# EAGLE design ring24 (EAGLE 6.4)
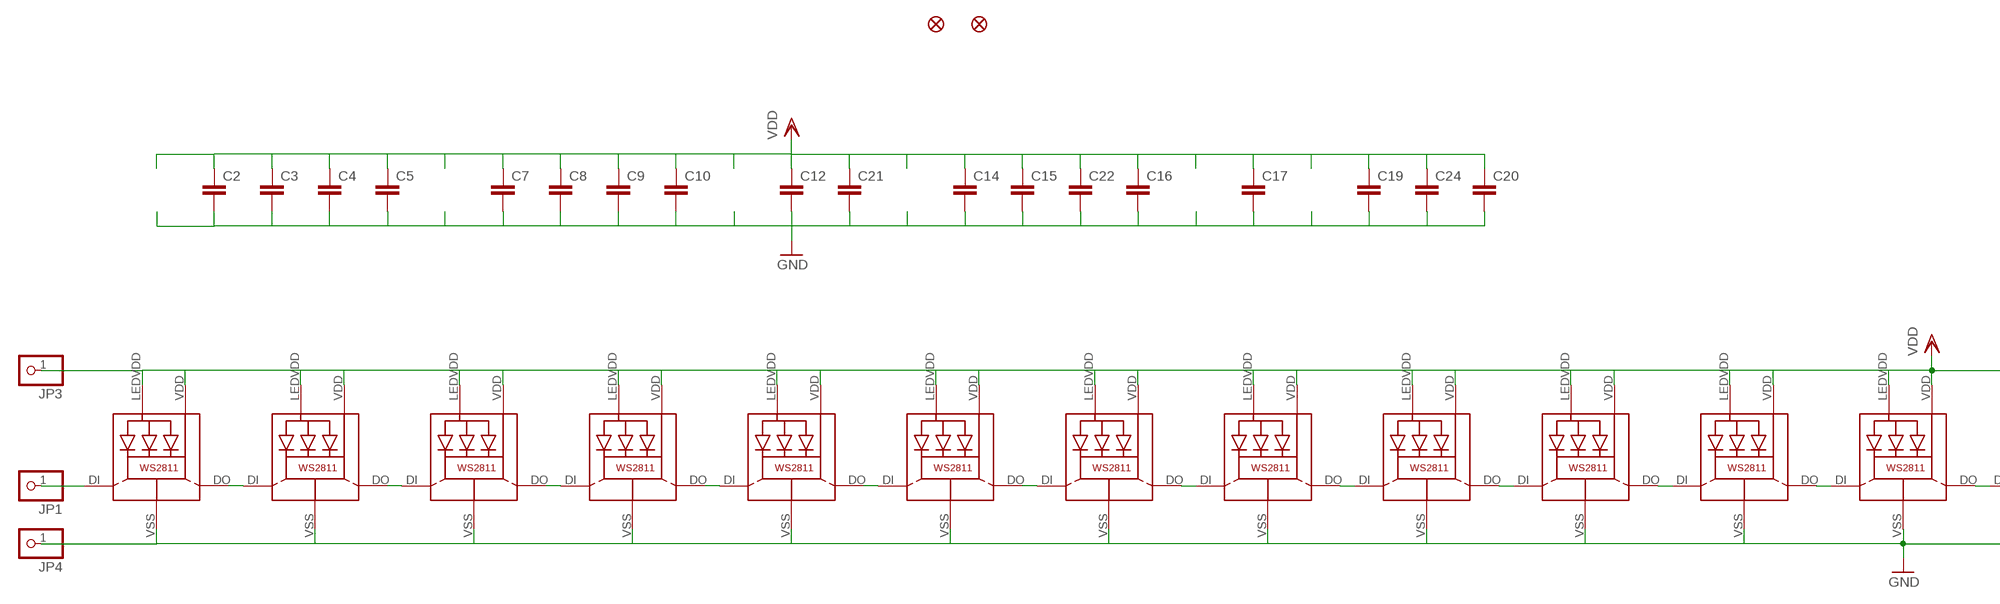
[diagram p0: schematic, sheet 1, part 1 of 2]
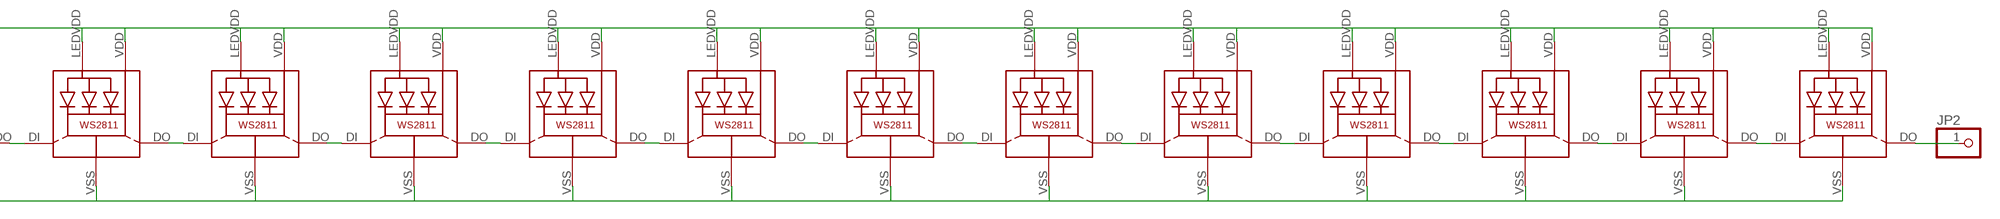
[diagram p1: schematic, sheet 1, part 2 of 2]

## Parts
C2  C-EUC0603  [C0603]
C3  C-EUC0603  [C0603]
C4  C-EUC0603  [C0603]
C5  C-EUC0603  [C0603]
C7  C-EUC0603  [C0603]
C8  C-EUC0603  [C0603]
C9  C-EUC0603  [C0603]
C10  C-EUC0603  [C0603]
C12  C-EUC0603  [C0603]
C14  C-EUC0603  [C0603]
C15  C-EUC0603  [C0603]
C16  C-EUC0603  [C0603]
C17  C-EUC0603  [C0603]
C19  C-EUC0603  [C0603]
C20  C-EUC0603  [C0603]
C21  C-EUC0603  [C0603]
C22  C-EUC0603  [C0603]
C24  C-EUC0603  [C0603]
FID1  FIDUCIAL""  [FIDUCIAL_1MM]
FID2  FIDUCIAL""  [FIDUCIAL_1MM]
JP1  PINHD-1X1CB  [1X01-CLEANBIG]
JP2  PINHD-1X1CB  [1X01-CLEANBIG]
JP3  PINHD-1X1CB  [1X01-CLEANBIG]
JP4  PINHD-1X1CB  [1X01-CLEANBIG]
LED1  WS28115050  [WS28115050]
LED2  WS28115050  [WS28115050]
LED3  WS28115050  [WS28115050]
LED4  WS28115050  [WS28115050]
LED5  WS28115050  [WS28115050]
LED6  WS28115050  [WS28115050]
LED7  WS28115050  [WS28115050]
LED8  WS28115050  [WS28115050]
LED9  WS28115050  [WS28115050]
LED10  WS28115050  [WS28115050]
LED11  WS28115050  [WS28115050]
LED12  WS28115050  [WS28115050]
LED13  WS28115050  [WS28115050]
LED14  WS28115050  [WS28115050]
LED15  WS28115050  [WS28115050]
LED16  WS28115050  [WS28115050]
LED17  WS28115050  [WS28115050]
LED18  WS28115050  [WS28115050]
LED19  WS28115050  [WS28115050]
LED20  WS28115050  [WS28115050]
LED21  WS28115050  [WS28115050]
LED22  WS28115050  [WS28115050]
LED23  WS28115050  [WS28115050]
LED24  WS28115050  [WS28115050]

## Nets
GND: C2.2 C3.2 C4.2 C5.2 C7.2 C8.2 C9.2 C10.2 C12.2 C14.2 C15.2 C16.2 C17.2 C19.2 C20.2 C21.2 C22.2 C24.2 JP4.1 LED1.VSS(GND) LED2.VSS(GND) LED3.VSS(GND) LED4.VSS(GND) LED5.VSS(GND) LED6.VSS(GND) LED7.VSS(GND) LED8.VSS(GND) LED9.VSS(GND) LED10.VSS(GND) LED11.VSS(GND) LED12.VSS(GND) LED13.VSS(GND) LED14.VSS(GND) LED15.VSS(GND) LED16.VSS(GND) LED17.VSS(GND) LED18.VSS(GND) LED19.VSS(GND) LED20.VSS(GND) LED21.VSS(GND) LED22.VSS(GND) LED23.VSS(GND) LED24.VSS(GND)
N$1: LED1.DO LED2.DI
N$2: LED2.DO LED3.DI
N$3: LED3.DO LED4.DI
N$4: LED4.DO LED5.DI
N$5: LED5.DO LED6.DI
N$6: LED6.DO LED7.DI
N$7: LED7.DO LED8.DI
N$8: LED8.DO LED9.DI
N$9: LED9.DO LED10.DI
N$10: LED10.DO LED11.DI
N$11: LED11.DO LED12.DI
N$12: LED12.DO LED13.DI
N$13: LED13.DO LED14.DI
N$14: LED14.DO LED15.DI
N$15: LED15.DO LED16.DI
N$16: LED16.DO LED17.DI
N$17: LED17.DO LED18.DI
N$18: LED18.DO LED19.DI
N$19: LED19.DO LED20.DI
N$20: LED20.DO LED21.DI
N$21: LED21.DO LED22.DI
N$22: LED22.DO LED23.DI
N$23: LED23.DO LED24.DI
N$24: JP2.1 LED24.DO
N$26: JP1.1 LED1.DI
VDD: C2.1 C3.1 C4.1 C5.1 C7.1 C8.1 C9.1 C10.1 C12.1 C14.1 C15.1 C16.1 C17.1 C19.1 C20.1 C21.1 C22.1 C24.1 JP3.1 LED1.LEDVDD LED1.VDD LED2.LEDVDD LED2.VDD LED3.LEDVDD LED3.VDD LED4.LEDVDD LED4.VDD LED5.LEDVDD LED5.VDD LED6.LEDVDD LED6.VDD LED7.LEDVDD LED7.VDD LED8.LEDVDD LED8.VDD LED9.LEDVDD LED9.VDD LED10.LEDVDD LED10.VDD LED11.LEDVDD LED11.VDD LED12.LEDVDD LED12.VDD LED13.LEDVDD LED13.VDD LED14.LEDVDD LED14.VDD LED15.LEDVDD LED15.VDD LED16.LEDVDD LED16.VDD LED17.LEDVDD LED17.VDD LED18.LEDVDD LED18.VDD LED19.LEDVDD LED19.VDD LED20.LEDVDD LED20.VDD LED21.LEDVDD LED21.VDD LED22.LEDVDD LED22.VDD LED23.LEDVDD LED23.VDD LED24.LEDVDD LED24.VDD

## Library data of the parts
C2-C5 C7-C10 C12 C14-C17 C19-C22 C24 = rcl:C-EU: CAPACITOR, European symbol
FID1 FID2 = microbuilder:FIDUCIAL: Fiducial Alignment Points Various fiducial points for machine vision alignment.; BOM: EXCLUDE
JP1-JP4 = NeoPixelRing:PINHD-1X1: Pin header 1x1 for 0.1" spacing With round pins
LED1-LED24 = microbuilder:WS28115050

## Board
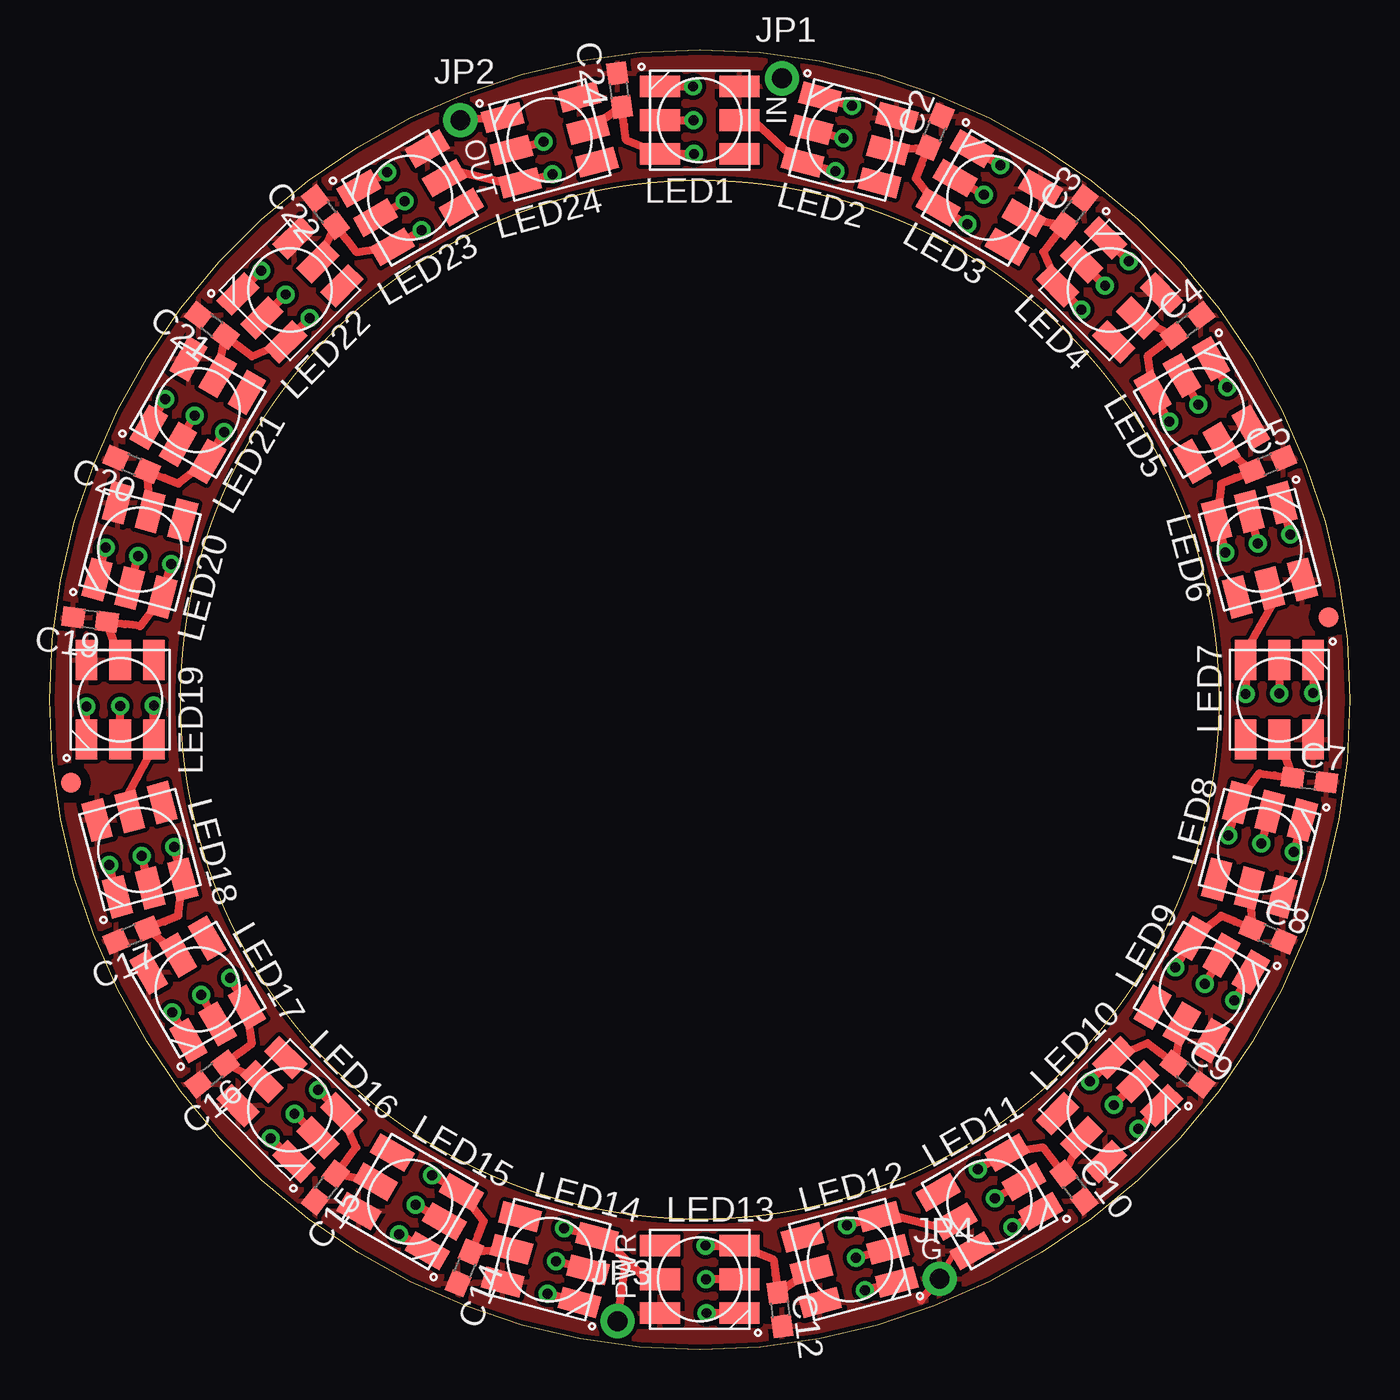
[diagram p2: board, top side]
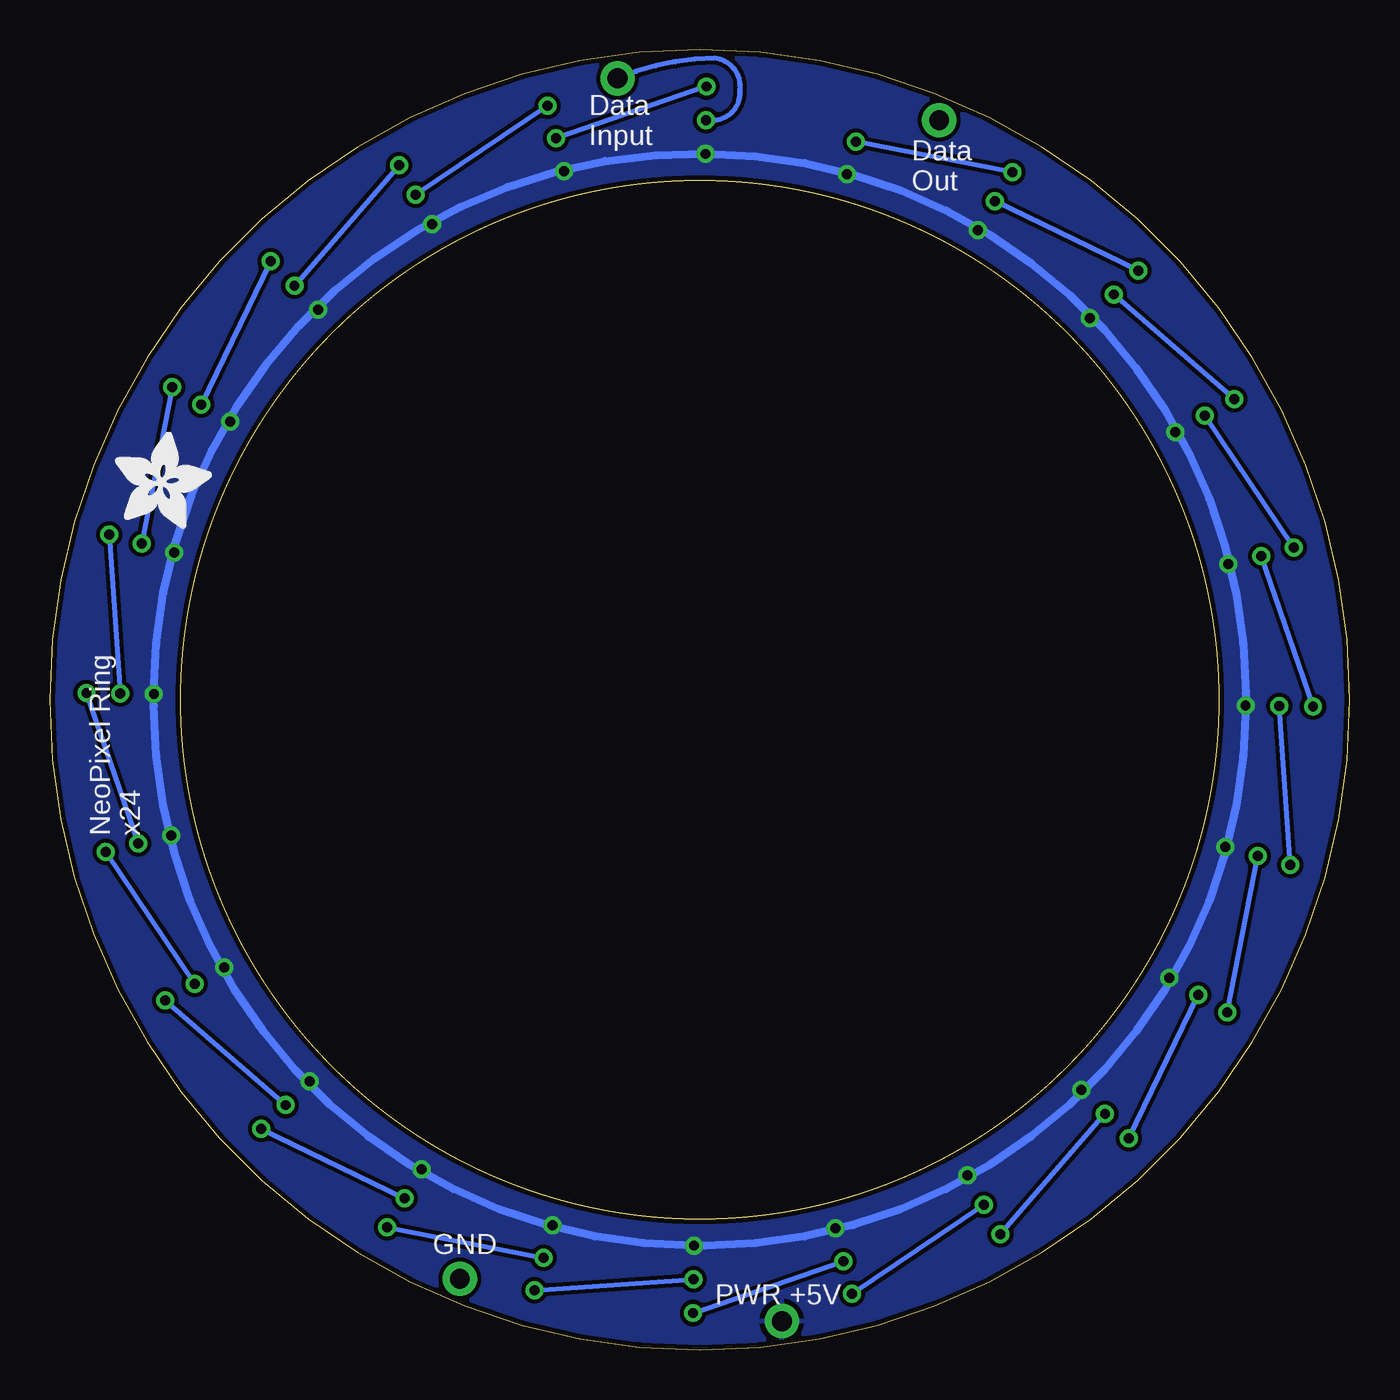
[diagram p3: board, bottom side, seen from below]

Size 65.53 x 65.53 mm. Coordinates in mm from the lower left corner, seen from the top.
Outline: 0,32.77 arc-90 32.77,65.53 arc-90 65.53,32.77 arc-90 32.77,0 arc-90 0,32.77
Outline: circle at 32.77,32.77 radius 26.16
Copper layers (1*16): Top 0.035mm / dielectric 1.5mm / Bottom 0.035mm
Design rules "adafruit": minimum track width 8mil, minimum drill 15.5mil, track to track 8mil, track to pad 8mil, pad to pad 8mil, via to via 8mil, smd to smd 8mil, copper to edge 10mil, drill to drill 8mil, minimum pad ring 10mil, minimum via ring 8mil, stop-mask expansion 4mil, vias tented up to drill 20mil, thermal gap 10mil
tRestrict: 1 lines

### Footprints (pad centres in the part's own frame; a part is rotated, then mirrored left to right if it is on the bottom)
C0603 = smd 1.1 x 1: 1 -0.85,0; 2 0.85,0
FIDUCIAL_1MM = smd 1 x 1: 1 0,0
1X01-CLEANBIG = drill 1 pad 1.727: 1 0,0
WS28115050 = smd 2 x 1.1: DI 2,0; DO 2,-1.7; LEDVDD -2,0; NC -2,1.7; VDD 2,1.7; VSS -2,-1.7

### Placement (x,y rotation side)
C2  44.62,61.4 67.5 top
C3  51.63,57.35 52.5 top
C4  57.35,51.63 37.5 top
C5  61.4,44.62 22.5 top
C7  63.49,28.72 352.5 top
C8  61.4,20.91 337.5 top
C9  57.35,13.9 322.5 top
C10  51.63,8.18 307.5 top
C12  36.81,2.04 277.5 top
C14  20.91,4.14 247.5 top
C15  13.9,8.18 232.5 top
C16  8.18,13.9 217.5 top
C17  4.14,20.91 202.5 top
C19  2.04,36.81 172.5 top
C20  4.14,44.62 157.5 top
C21  8.18,51.63 142.5 top
C22  13.9,57.35 127.5 top
C24  28.72,63.49 97.5 top
FID1  1.07,28.57 0 top
FID2  64.47,36.93 0 top
JP1  36.91,64.08 0 top
JP2  20.7,61.98 0 top
JP3  28.63,1.45 0 top
JP4  44.86,3.58 0 top
LED1  32.77,61.98 180 top
LED2  40.33,60.98 165 top
LED3  47.37,58.06 150 top
LED4  53.42,53.42 135 top
LED5  58.06,47.37 120 top
LED6  60.98,40.33 105 top
LED7  61.98,32.77 90 top
LED8  60.98,25.21 75 top
LED9  58.06,18.16 60 top
LED10  53.42,12.11 45 top
LED11  47.37,7.47 30 top
LED12  40.33,4.55 15 top
LED13  32.77,3.56 0 top
LED14  25.21,4.55 345 top
LED15  18.16,7.47 330 top
LED16  12.11,12.11 315 top
LED17  7.47,18.16 300 top
LED18  4.55,25.21 285 top
LED19  3.56,32.77 270 top
LED20  4.55,40.33 255 top
LED21  7.47,47.37 240 top
LED22  12.11,53.42 225 top
LED23  18.16,58.06 210 top
LED24  25.21,60.98 195 top
U$1  [ADAFRUIT_5MM]  62.23,41.4 0 bottom

### Tracks (layer width: path | path; a pad name or v marks a point on that pad's centre or on a via)
GND
  Top 0.305: JP4.1 45.59,4.93
  Top 0.406: 43.92,2.49 JP4.1
  pour Top: -18.03,83.57 -18.03,-18.03 83.57,-18.03 83.57,83.57
N$1  (via drill 0.5)
  Top 0.406: LED1.DO v32.43,63.67 | LED2.DI v40.02,61.06
  Bottom 0.254: v32.43,63.67 v40.02,61.06
N$2  (via drill 0.5)
  Top 0.406: LED2.DO v40.44,62.71 | LED3.DI v47.09,58.22
  Bottom 0.254: v40.44,62.71 v47.09,58.22
N$3  (via drill 0.5)
  Top 0.406: LED4.DI v53.19,53.64 | LED3.DO v47.93,59.7
  Bottom 0.254: v47.93,59.7 v53.19,53.64
N$4  (via drill 0.5)
  Top 0.406: LED5.DI v57.9,47.65 | LED4.DO v54.38,54.86
  Bottom 0.254: v54.38,54.86 v57.9,47.65
N$5  (via drill 0.5)
  Top 0.406: LED5.DO v59.36,48.51 | LED6.DI v60.9,40.63
  Bottom 0.254: v59.36,48.51 v60.9,40.63
N$6  (via drill 0.5)
  Top 0.406: LED6.DO v62.53,41.09 | LED7.DI v61.97,33.09
  Bottom 0.254: v62.53,41.09 v61.97,33.09
N$7  (via drill 0.5)
  Top 0.406: LED7.DO v63.67,33.1 | LED8.DI v61.06,25.51
  Bottom 0.254: v63.67,33.1 v61.06,25.51
N$8  (via drill 0.5)
  Top 0.406: LED8.DO v62.71,25.09 | LED9.DI v58.22,18.44
  Bottom 0.254: v62.71,25.09 v58.22,18.44
N$9  (via drill 0.5)
  Top 0.406: LED9.DO v59.7,17.6 | LED10.DI v53.64,12.34
  Bottom 0.254: v59.7,17.6 v53.64,12.34
N$10  (via drill 0.5)
  Top 0.406: LED10.DO v54.86,11.15 | LED11.DI v47.65,7.63
  Bottom 0.254: v54.86,11.15 v47.65,7.63
N$11  (via drill 0.5)
  Top 0.406: LED11.DO v48.51,6.17 | LED12.DI v40.63,4.63
  Bottom 0.254: v48.51,6.17 v40.63,4.63
N$12  (via drill 0.5)
  Top 0.406: LED12.DO v41.09,3 | LED13.DI v33.09,3.56
  Bottom 0.254: v41.09,3 v33.09,3.56
N$13  (via drill 0.5)
  Top 0.406: LED13.DO v33.1,1.86 | LED14.DI v25.51,4.47
  Bottom 0.254: v33.1,1.86 v25.51,4.47
N$14  (via drill 0.5)
  Top 0.406: LED14.DO v25.09,2.82 | LED15.DI v18.44,7.31
  Bottom 0.254: v25.09,2.82 v18.44,7.31
N$15  (via drill 0.5)
  Top 0.406: LED15.DO v17.6,5.83 | v12.34,11.89 LED16.DI
  Bottom 0.254: v17.6,5.83 v12.34,11.89
N$16  (via drill 0.5)
  Top 0.406: LED16.DO v11.15,10.67 | LED17.DI v7.63,17.89
  Bottom 0.254: v11.15,10.67 v7.63,17.89
N$17  (via drill 0.5)
  Top 0.406: LED17.DO v6.17,17.02 | LED18.DI v4.63,24.9
  Bottom 0.254: v6.17,17.02 v4.63,24.9
N$18  (via drill 0.5)
  Top 0.406: LED18.DO v3,24.44 | LED19.DI v3.56,32.45
  Bottom 0.254: v3,24.44 v3.56,32.45
N$19  (via drill 0.5)
  Top 0.406: LED19.DO v1.86,32.43 | LED20.DI v4.47,40.02
  Bottom 0.254: v1.86,32.43 v4.47,40.02
N$20  (via drill 0.5)
  Top 0.406: LED20.DO v2.82,40.44 | LED21.DI v7.31,47.09
  Bottom 0.254: v2.82,40.44 v7.31,47.09
N$21  (via drill 0.5)
  Top 0.406: LED21.DO v5.83,47.93 | LED22.DI v11.89,53.19
  Bottom 0.254: v5.83,47.93 v11.89,53.19
N$22  (via drill 0.5)
  Top 0.406: LED22.DO v10.67,54.38 | LED23.DI v17.89,57.9
  Bottom 0.254: v10.67,54.38 v17.89,57.9
N$23  (via drill 0.5)
  Top 0.406: LED23.DO v17.02,59.36 | LED24.DI v24.9,60.9
  Bottom 0.254: v17.02,59.36 v24.9,60.9
N$24
  Top 0.406: LED24.DO JP2.1
N$26  (via drill 0.5)
  Top 0.406: LED1.DI v32.45,61.97
  Bottom 0.254: v32.45,61.97 32.01,61.97 arc-90 30.73,63.5 arc-90 32,65.1 arc-22 JP1.1
VDD  (via drill 0.5)
  Top 0.406: LED24.LEDVDD C24.1 28.95,61.73 29.05,60.97 LED1.VDD v32.47,60.27 | v39.6,59.41 LED2.VDD 37.29,60.27 35.59,61.87 LED1.LEDVDD | v46.26,56.74 LED3.VDD 43.65,59.05 43.94,59.75 C2.1 LED2.LEDVDD | LED3.LEDVDD C3.1 50.55,55.94 50.08,55.33 LED4.VDD v52,52.43 | v56.44,46.78 LED5.VDD 55.33,50.08 55.94,50.55 C4.1 LED4.LEDVDD | LED5.LEDVDD C5.1 59.75,43.94 59.05,43.65 LED6.VDD v59.26,40.17 | LED7.LEDVDD C7.1 61.73,28.95 60.97,29.05 LED8.VDD v59.41,25.94 | LED8.LEDVDD C8.1 59.75,21.59 59.05,21.88 LED9.VDD v56.74,19.27 | LED9.LEDVDD C9.1 55.94,14.98 55.33,15.45 LED10.VDD v52.43,13.53 | LED10.LEDVDD C10.1 50.55,9.59 50.08,10.2 LED11.VDD v46.78,9.09 | v40.17,6.27 LED12.VDD 42.52,6.76 45.06,6.1 LED11.LEDVDD | LED12.LEDVDD C12.1 36.58,3.81 36.48,4.56 LED13.VDD v33.07,5.26 | v25.94,6.12 LED14.VDD 28.14,5.44 30.07,3.53 LED13.LEDVDD | LED14.LEDVDD C14.1 21.59,5.78 21.88,6.48 LED15.VDD v19.27,8.79 | LED15.LEDVDD C15.1 14.98,9.59 15.45,10.2 LED16.VDD v13.53,13.1 | LED16.LEDVDD C16.1 9.59,14.98 10.2,15.45 LED17.VDD v9.09,18.75 | LED17.LEDVDD C17.1 5.78,21.59 6.48,21.88 LED18.VDD v6.27,25.36 | LED19.LEDVDD C19.1 3.81,36.58 4.56,36.48 LED20.VDD v6.12,39.6 | LED20.LEDVDD C20.1 5.78,43.94 6.48,43.65 LED21.VDD v8.79,46.26 | v13.1,52 LED22.VDD 10.2,50.08 9.59,50.55 C21.1 LED21.LEDVDD | LED22.LEDVDD C22.1 14.98,55.94 15.45,55.33 LED23.VDD v18.75,56.44 | v25.36,59.26 LED24.VDD 23.04,58.8 20.68,59.38 LED23.LEDVDD | v5.26,32.47 LED19.VDD 5.03,29.95 3.94,27.96 LED18.LEDVDD | v60.27,33.07 LED7.VDD 60.5,35.61 61.67,37.64 LED6.LEDVDD | JP3.1 29.06,4.47
  Bottom 0.406: v32.47,60.27 arc90 5.26,33.07 v5.26,32.47 arc90 32.47,5.26 v33.07,5.26 arc90 60.27,32.47 v60.27,33.07 arc91 v32.47,60.27
  pour Bottom: -18.03,83.57 -18.03,-18.03 83.57,-18.03 83.57,83.57

### Text on the board
tPlace: IN | OUT | G | PWR
bPlace: Data / Input | Data / Out | NeoPixel Ring / x24 | GND | PWR +5V